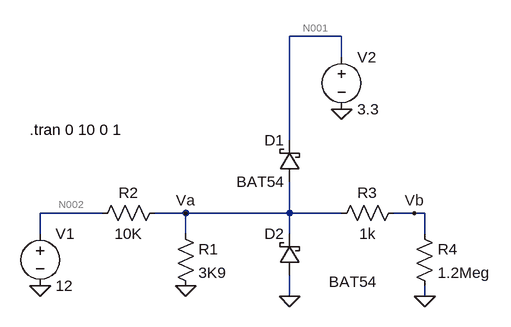
[diagram p0: schematic Version2CircuitoVDC.asc]
Version2CircuitoVDC.asc, the LTspice schematic file:
Version 4
SHEET 1 880 680
WIRE 384 -208 304 -208
WIRE 384 -176 384 -208
WIRE 304 -48 304 -208
WIRE 16 64 -80 64
WIRE 144 64 96 64
WIRE 304 64 304 16
WIRE 304 64 144 64
WIRE 384 64 304 64
WIRE 496 64 464 64
WIRE 512 64 496 64
WIRE -80 96 -80 64
WIRE 144 96 144 64
WIRE 304 96 304 64
WIRE 512 96 512 64
WIRE 304 192 304 160
WIRE 512 192 512 176
FLAG -80 176 0
FLAG 144 176 0
FLAG 144 64 Va
FLAG 496 64 Vb
FLAG 512 192 0
FLAG 384 -96 0
FLAG 304 192 0
SYMBOL res 128 80 R0
SYMATTR InstName R1
SYMATTR Value 3K9
SYMBOL res 112 48 R90
WINDOW 0 0 56 VBottom 2
WINDOW 3 32 56 VTop 2
SYMATTR InstName R2
SYMATTR Value 10K
SYMBOL voltage -80 80 R0
WINDOW 123 0 0 Left 0
WINDOW 39 0 0 Left 0
SYMATTR InstName V1
SYMATTR Value 12
SYMBOL res 480 48 R90
WINDOW 0 0 56 VBottom 2
WINDOW 3 32 56 VTop 2
SYMATTR InstName R3
SYMATTR Value 1k
SYMBOL res 496 80 R0
SYMATTR InstName R4
SYMATTR Value 1.2Meg
SYMBOL schottky 320 16 R180
WINDOW 0 24 64 Left 2
WINDOW 3 24 0 Left 2
SYMATTR InstName D1
SYMATTR Value BAT54
SYMATTR Description Diode
SYMATTR Type diode
SYMBOL schottky 320 160 R180
WINDOW 0 24 64 Left 2
WINDOW 3 -118 -10 Left 2
SYMATTR InstName D2
SYMATTR Value BAT54
SYMATTR Description Diode
SYMATTR Type diode
SYMBOL voltage 384 -192 R0
WINDOW 123 0 0 Left 0
WINDOW 39 0 0 Left 0
SYMATTR InstName V2
SYMATTR Value 3.3
TEXT -96 -64 Left 2 !.tran 0 10 0 1

The netlist it stands for:
* Version2CircuitoVDC.asc
R1 Va 0 3K9
R2 Va N002 10K
V1 N002 0 12
R3 Vb Va 1k
R4 Vb 0 1.2Meg
D1 Va N001 BAT54
D2 0 Va BAT54
V2 N001 0 3.3
.model D D
.lib standard.dio
.tran 0 10 0 1
.backanno
.end

* Results of the author's LTspice run, read from the files saved beside the schematic
* Operating Point, zero values left out:
*   V(va) = 3.291 V
*   V(n002) = 12 V
*   V(vb) = 3.288 V
*   V(n001) = 3.3 V
*   I(D2) = -31.7 µA
*   I(D1) = -7.287 µA
*   I(R4) = 2.74 µA
*   I(R3) = -2.74 µA
*   I(R2) = -870.9 µA
*   I(R1) = 843.8 µA
*   I(V2) = -7.287 µA
*   I(V1) = -870.9 µA